# Altium project MicArrayPCB_V3.PrjPcb
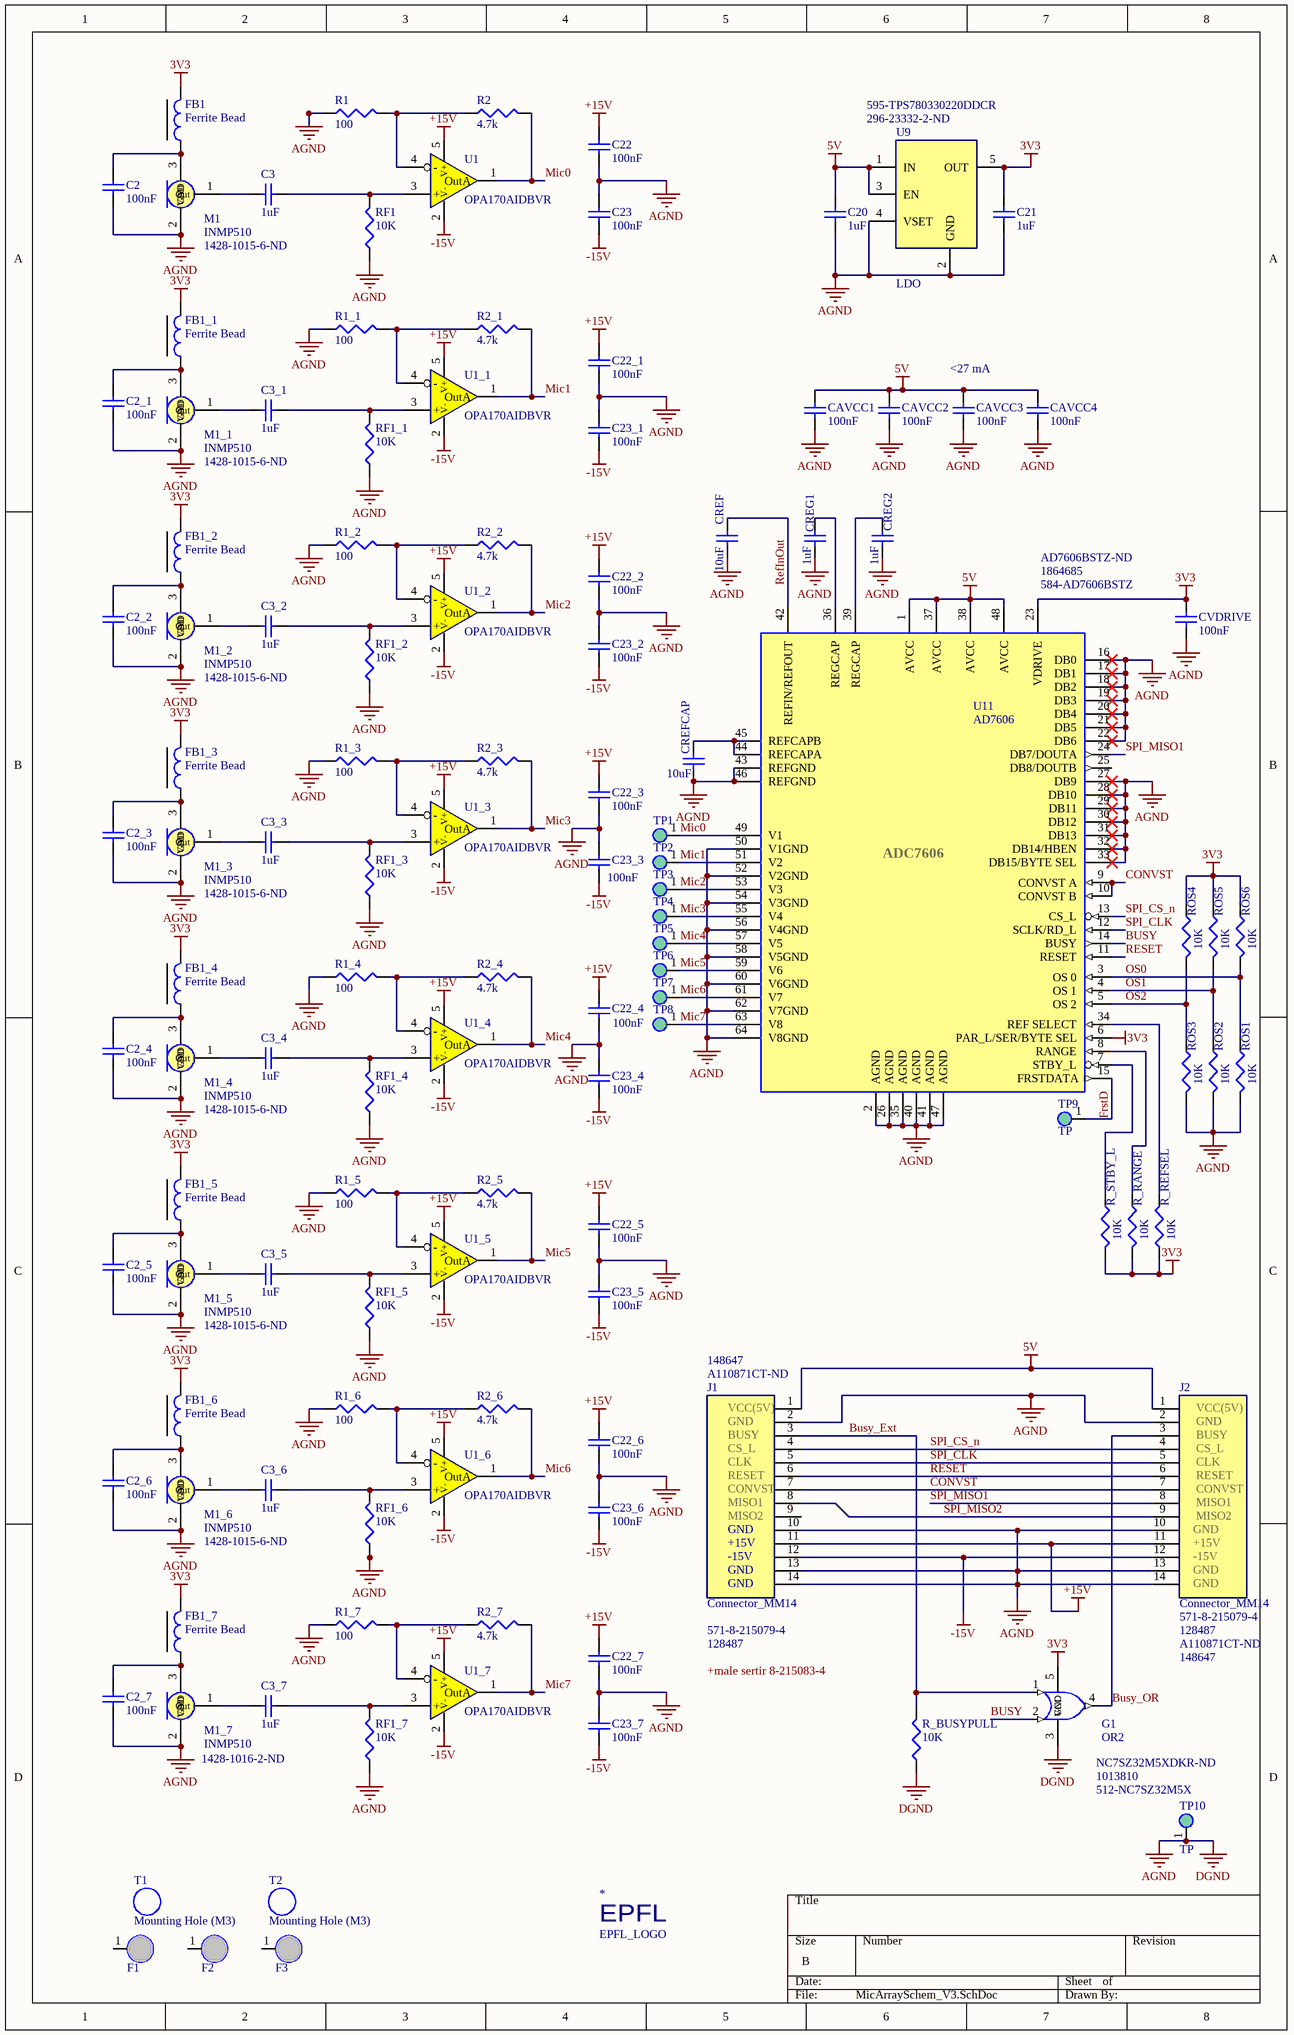
[diagram p0: MicArraySchem_V3.SchDoc]
1 sheet, 122 parts. Net scope: global (net labels, ports and power ports of the same name join across sheets).
Board file: MicArrayPCBBoard_V3.PcbDoc

## Sheet MicArraySchem_V3.SchDoc
size B portrait; PageSetup: Record=PageOptions|CenterHorizontal=True|CenterVertical=True|PrintScale=0.70|XCorrection=1.00|YCorrection=1.00|PrintKind=1|BorderSize=5000000|LeftOffset=0|BottomOffset=0|Orientation=1|PaperLength=2794|PaperWidth=2159|Scale=100|PaperSource=7|PrintQuality=600|MediaType=1|DitherType=10|PrintScaleMode=1|PaperKind=Letter (8,5" x 11")|PaperIndex=1

### Parts
*  EPFL_LOGO  [EPFL_Logo]
C2  100nF  [1608[0603]]
C2_1  100nF  [1608[0603]]
C2_2  100nF  [1608[0603]]
C2_3  100nF  [1608[0603]]
C2_4  100nF  [1608[0603]]
C2_5  100nF  [1608[0603]]
C2_6  100nF  [1608[0603]]
C2_7  100nF  [1608[0603]]
C3  1uF  [1608[0603]]
C3_1  1uF  [1608[0603]]
C3_2  1uF  [1608[0603]]
C3_3  1uF  [1608[0603]]
C3_4  1uF  [1608[0603]]
C3_5  1uF  [1608[0603]]
C3_6  1uF  [1608[0603]]
C3_7  1uF  [1608[0603]]
C20  1uF  [1608[0603]]
C21  1uF  [1608[0603]]
C22  100nF  [1608[0603]]
C22_1  100nF  [1608[0603]]
C22_2  100nF  [1608[0603]]
C22_3  100nF  [1608[0603]]
C22_4  100nF  [1608[0603]]
C22_5  100nF  [1608[0603]]
C22_6  100nF  [1608[0603]]
C22_7  100nF  [1608[0603]]
C23  100nF  [1608[0603]]
C23_1  100nF  [1608[0603]]
C23_2  100nF  [1608[0603]]
C23_3  100nF  [1608[0603]]
C23_4  100nF  [1608[0603]]
C23_5  100nF  [1608[0603]]
C23_6  100nF  [1608[0603]]
C23_7  100nF  [1608[0603]]
CAVCC1  100nF  [1608[0603]]
CAVCC2  100nF  [1608[0603]]
CAVCC3  100nF  [1608[0603]]
CAVCC4  100nF  [1608[0603]]
CREF  10uF  [1608[0603]]
CREFCAP  10uF  [1608[0603]]
CREG1  1uF  [1608[0603]]
CREG2  1uF  [1608[0603]]
CVDRIVE  100nF  [1608[0603]]
F1  *  [Fiducial_round_2mm]  (value not drawn)
F2  *  [Fiducial_round_2mm]  (value not drawn)
F3  *  [Fiducial_round_2mm]  (value not drawn)
FB1  Ferrite Bead  [L_0603]
FB1_1  Ferrite Bead  [L_0603]
FB1_2  Ferrite Bead  [L_0603]
FB1_3  Ferrite Bead  [L_0603]
FB1_4  Ferrite Bead  [L_0603]
FB1_5  Ferrite Bead  [L_0603]
FB1_6  Ferrite Bead  [L_0603]
FB1_7  Ferrite Bead  [L_0603]
G1  OR2  Supplier Part Number 1: 512-NC7SZ32M5X  Supplier Part Number 2: 1013810  Supplier Part Number 3: NC7SZ32M5XDKR-ND  [SOT65P210X110-5N]
J1  Connector_MM14  Supplier Part Number 2: 571-8-215079-4  Supplier Part Number 4: 128487  Supplier Part Number 3: A110871CT-ND  Supplier Part Number 1: 148647  [MM14 _TH_FEMALE]
J2  Connector_MM14  Supplier Part Number 2: 571-8-215079-4  Supplier Part Number 4: 128487  Supplier Part Number 3: A110871CT-ND  Supplier Part Number 1: 148647  [MM14 _TH_FEMALE]
M1  INMP510  Supplier Part Number 1: 1428-1015-6-ND  [INMP504]
M1_1  INMP510  Supplier Part Number 1: 1428-1015-6-ND  [INMP504]
M1_2  INMP510  Supplier Part Number 1: 1428-1015-6-ND  [INMP504]
M1_3  INMP510  Supplier Part Number 1: 1428-1015-6-ND  [INMP504]
M1_4  INMP510  Supplier Part Number 1: 1428-1015-6-ND  [INMP504]
M1_5  INMP510  Supplier Part Number 1: 1428-1015-6-ND  [INMP504]
M1_6  INMP510  Supplier Part Number 1: 1428-1015-6-ND  [INMP504]
M1_7  INMP510  Supplier Part Number 1: 1428-1016-2-ND  [INMP504]
R1  100  [J1-0603]
R1_1  100  [J1-0603]
R1_2  100  [J1-0603]
R1_3  100  [J1-0603]
R1_4  100  [J1-0603]
R1_5  100  [J1-0603]
R1_6  100  [J1-0603]
R1_7  100  [J1-0603]
R2  4.7k  [J1-0603]
R2_1  4.7k  [J1-0603]
R2_2  4.7k  [J1-0603]
R2_3  4.7k  [J1-0603]
R2_4  4.7k  [J1-0603]
R2_5  4.7k  [J1-0603]
R2_6  4.7k  [J1-0603]
R2_7  4.7k  [J1-0603]
R_BUSYPULL  10K  [J1-0603]
R_RANGE  10K  [J1-0603]
R_REFSEL  10K  [J1-0603]
R_STBY_L  10K  [J1-0603]
RF1  10K  [J1-0603]
RF1_1  10K  [J1-0603]
RF1_2  10K  [J1-0603]
RF1_3  10K  [J1-0603]
RF1_4  10K  [J1-0603]
RF1_5  10K  [J1-0603]
RF1_6  10K  [J1-0603]
RF1_7  10K  [J1-0603]
ROS1  10K  [J1-0603]
ROS2  10K  [J1-0603]
ROS3  10K  [J1-0603]
ROS4  10K  [J1-0603]
ROS5  10K  [J1-0603]
ROS6  10K  [J1-0603]
T1  Mounting Hole (M3)  [M3MountingHole]
T2  Mounting Hole (M3)  [M3MountingHole]
TP1  TP  [TP_0.75mm]  (value not drawn)
TP2  TP  [TP_0.75mm]  (value not drawn)
TP3  TP  [TP_0.75mm]  (value not drawn)
TP4  TP  [TP_0.75mm]  (value not drawn)
TP5  TP  [TP_0.75mm]  (value not drawn)
TP6  TP  [TP_0.75mm]  (value not drawn)
TP7  TP  [TP_0.75mm]  (value not drawn)
TP8  TP  [TP_0.75mm]  (value not drawn)
TP9  TP  [TP_0.75mm]
TP10  TP  [TP_1mm]
U1  OPA170AIDBVR  [SOT95P280X145-5N]
U1_1  OPA170AIDBVR  [SOT95P280X145-5N]
U1_2  OPA170AIDBVR  [SOT95P280X145-5N]
U1_3  OPA170AIDBVR  [SOT95P280X145-5N]
U1_4  OPA170AIDBVR  [SOT95P280X145-5N]
U1_5  OPA170AIDBVR  [SOT95P280X145-5N]
U1_6  OPA170AIDBVR  [SOT95P280X145-5N]
U1_7  OPA170AIDBVR  [SOT95P280X145-5N]
U9  LDO  Supplier Part Number 1: 296-23332-2-ND  Supplier Part Number 2: 595-TPS780330220DDCR  [SOT95P280X110-5N]
U11  AD7606  Supplier Part Number 1: AD7606BSTZ-ND  Supplier Part Number 2: 1864685  Supplier Part Number 3: 584-AD7606BSTZ  [LPQF-Quad64]

### Nets
3V3: C21.2 CVDRIVE.1 FB1.2 FB1_1.2 FB1_2.2 FB1_3.2 FB1_4.2 FB1_5.2 FB1_6.2 FB1_7.2 G1.5(VCC) R_RANGE.2 R_REFSEL.1 R_STBY_L.2 ROS4.1 ROS5.1 ROS6.1 U9.5(OUT) U11.6(PAR_L/SER/BYTE_SEL) U11.23(VDRIVE)
5V: C20.2 CAVCC1.2 CAVCC2.2 CAVCC3.2 CAVCC4.2 J1.1 J2.1 U9.1(IN) U9.3(EN) U11.1(AVCC) U11.37(AVCC) U11.38(AVCC) U11.48(AVCC)
+15V: C22.1 C22_1.1 C22_2.1 C22_3.1 C22_4.1 C22_5.1 C22_6.1 C22_7.1 J1.11 J2.11 U1.5(V+) U1_1.5(V+) U1_2.5(V+) U1_3.5(V+) U1_4.5(V+) U1_5.5(V+) U1_6.5(V+) U1_7.5(V+)
-15V: C23.2 C23_1.2 C23_2.2 C23_3.2 C23_4.2 C23_5.2 C23_6.2 C23_7.2 J1.12 J2.12 U1.2(V-) U1_1.2(V-) U1_2.2(V-) U1_3.2(V-) U1_4.2(V-) U1_5.2(V-) U1_6.2(V-) U1_7.2(V-)
AGND: C2.1 C2_1.1 C2_2.1 C2_3.1 C2_4.1 C2_5.1 C2_6.1 C2_7.1 C20.1 C21.1 C22.2 C22_1.2 C22_2.2 C22_3.2 C22_4.2 C22_5.2 C22_6.2 C22_7.2 C23.1 C23_1.1 C23_2.1 C23_3.1 C23_4.1 C23_5.1 C23_6.1 C23_7.1 CAVCC1.1 CAVCC2.1 CAVCC3.1 CAVCC4.1 CREF.1 CREFCAP.1 CREG1.1 CREG2.1 CVDRIVE.2 G1.3(GND) J1.2 J1.10 J1.13 J1.14 J2.2 J2.10 J2.13 J2.14 M1.2(GND) M1_1.2(GND) M1_2.2(GND) M1_3.2(GND) M1_4.2(GND) M1_5.2(GND) M1_6.2(GND) M1_7.2(GND) R1.1 R1_1.1 R1_2.1 R1_3.1 R1_4.1 R1_5.1 R1_6.1 R1_7.1 R_BUSYPULL.1 RF1.1 RF1_1.1 RF1_2.1 RF1_3.1 RF1_4.1 RF1_5.1 RF1_6.1 RF1_7.1 ROS1.2 ROS2.2 ROS3.2 TP10.1(TP) U9.2(GND) U9.4(VSET) U11.2(AGND) U11.16(DB0) U11.17(DB1) U11.18(DB2) U11.19(DB3) U11.20(DB4) U11.21(DB5) U11.22(DB6) U11.26(AGND) U11.27(DB9) U11.28(DB10) U11.29(DB11) U11.30(DB12) U11.31(DB13) U11.32(DB14/HBEN) U11.33(DB15/BYTE_SEL) U11.35(AGND) U11.40(AGND) U11.41(AGND) U11.43(REFGND) U11.46(REFGND) U11.47(AGND) U11.50(V1GND) U11.52(V2GND) U11.54(V3GND) U11.56(V4GND) U11.58(V5GND) U11.60(V6GND) U11.62(V7GND) U11.64(V8GND)  [also labelled DGND]
BUSY: G1.2 U11.14(BUSY)
Busy_Ext: G1.1 J1.3 R_BUSYPULL.2
Busy_OR: G1.4 J2.3
CONVST: J1.7 J2.7 U11.9(CONVST_A) U11.10(CONVST_B)
FrstD: TP9.1(TP) U11.15(FRSTDATA)
Mic0: R2.2 TP1.1(TP) U1.1(OutA) U11.49(V1)
Mic1: R2_1.2 TP2.1(TP) U1_1.1(OutA) U11.51(V2)
Mic2: R2_2.2 TP3.1(TP) U1_2.1(OutA) U11.53(V3)
Mic3: R2_3.2 TP4.1(TP) U1_3.1(OutA) U11.55(V4)
Mic4: R2_4.2 TP5.1(TP) U1_4.1(OutA) U11.57(V5)
Mic5: R2_5.2 TP6.1(TP) U1_5.1(OutA) U11.59(V6)
Mic6: R2_6.2 TP7.1(TP) U1_6.1(OutA) U11.61(V7)
Mic7: R2_7.2 TP8.1(TP) U1_7.1(OutA) U11.63(V8)
OS0: ROS1.1 ROS6.2 U11.3(OS_0)
OS1: ROS2.1 ROS5.2 U11.4(OS_1)
OS2: ROS3.1 ROS4.2 U11.5(OS_2)
RefInOut: CREF.2 U11.42(REFIN/REFOUT)
RESET: J1.6 J2.6 U11.11(RESET)
SPI_CLK: J1.5 J2.5 U11.12(SCLK/RD_L)
SPI_CS_n: J1.4 J2.4 U11.13(CS_L)
SPI_MISO1: J2.8 U11.24(DB7/DOUTA)
SPI_MISO2: J1.8 J2.9
NetC2_1_2: C2_1.2 FB1_1.1 M1_1.3(VDD)
NetC2_2: C2.2 FB1.1 M1.3(VDD)
NetC2_2_2: C2_2.2 FB1_2.1 M1_2.3(VDD)
NetC2_3_2: C2_3.2 FB1_3.1 M1_3.3(VDD)
NetC2_4_2: C2_4.2 FB1_4.1 M1_4.3(VDD)
NetC2_5_2: C2_5.2 FB1_5.1 M1_5.3(VDD)
NetC2_6_2: C2_6.2 FB1_6.1 M1_6.3(VDD)
NetC2_7_2: C2_7.2 FB1_7.1 M1_7.3(VDD)
NetC3_1: C3.1 M1.1(Out)
NetC3_1_1: C3_1.1 M1_1.1(Out)
NetC3_1_2: C3_1.2 RF1_1.2 U1_1.3(+)
NetC3_2: C3.2 RF1.2 U1.3(+)
NetC3_2_1: C3_2.1 M1_2.1(Out)
NetC3_2_2: C3_2.2 RF1_2.2 U1_2.3(+)
NetC3_3_1: C3_3.1 M1_3.1(Out)
NetC3_3_2: C3_3.2 RF1_3.2 U1_3.3(+)
NetC3_4_1: C3_4.1 M1_4.1(Out)
NetC3_4_2: C3_4.2 RF1_4.2 U1_4.3(+)
NetC3_5_1: C3_5.1 M1_5.1(Out)
NetC3_5_2: C3_5.2 RF1_5.2 U1_5.3(+)
NetC3_6_1: C3_6.1 M1_6.1(Out)
NetC3_6_2: C3_6.2 RF1_6.2 U1_6.3(+)
NetC3_7_1: C3_7.1 M1_7.1(Out)
NetC3_7_2: C3_7.2 RF1_7.2 U1_7.3(+)
NetCREFCAP_2: CREFCAP.2 U11.44(REFCAPA) U11.45(REFCAPB)
NetCREG1_2: CREG1.2 U11.36(REGCAP)
NetCREG2_2: CREG2.2 U11.39(REGCAP)
NetR1_1_2: R1_1.2 R2_1.1 U1_1.4(-)
NetR1_2: R1.2 R2.1 U1.4(-)
NetR1_2_2: R1_2.2 R2_2.1 U1_2.4(-)
NetR1_3_2: R1_3.2 R2_3.1 U1_3.4(-)
NetR1_4_2: R1_4.2 R2_4.1 U1_4.4(-)
NetR1_5_2: R1_5.2 R2_5.1 U1_5.4(-)
NetR1_6_2: R1_6.2 R2_6.1 U1_6.4(-)
NetR1_7_2: R1_7.2 R2_7.1 U1_7.4(-)
NetR_RANGE_1: R_RANGE.1 U11.8(RANGE)
NetR_REFSEL_2: R_REFSEL.2 U11.34(REF_SELECT)
NetR_STBY_L_1: R_STBY_L.1 U11.7(STBY_L)

Not connected (* = marked no-connect by the designer): F1 1; F2 1; F3 1; J1 9; U11 25(DB8/DOUTB)

### Notes on the sheet
- (near CAVCC3) <27 mA
- (near J1) VCC(5V)
- (near J1) GND
- (near J1) BUSY
- (near J2) VCC(5V)
- (near J2) GND
- (near J2) BUSY
- (near J1) CLK
- (near J1) CS_L
- (near J1) CONVST
- (near J1) RESET
- (near J1) MISO1
- (near J1) MISO2
- (near J2) CLK
- (near J2) CS_L
- (near J2) CONVST
- (near J2) RESET
- (near J2) MISO1
- (near J2) MISO2
- (near J1) +15V
- (near J1) -15V
- (near J2) +15V
- (near J2) -15V
- +male sertir 8-215083-4
- (in symbol AD7606) ADC7606
- (in symbol EPFL_LOGO) EPFL

### Library data of the parts
C2 C2_1-C2_7 C3 C3_1-C3_7 C20-C22 C22_1-C22_7 C23 C23_1-C23_7 CAVCC1-CAVCC4 CREF CREFCAP CREG1 CREG2 CVDRIVE = Cap Semi: Capacitor (Semiconductor SIM Model)
  C2 C2_1-C2_7 CAVCC1-CAVCC4 CVDRIVE: Published: 8-Jun-2000; LatestRevisionDate: 29-May-2009; LatestRevisionNote: IPC-7351 Footprint Added.; PackageReference: C1206; Publisher: Altium Limited; PackageDescription: Chip Capacitor; Value: 100nF
  C3: Package: 0603; Value: 1uF
  C3_1-C3_7 C20 C21 CREG1 CREG2: Published: 8-Jun-2000; LatestRevisionDate: 29-May-2009; LatestRevisionNote: IPC-7351 Footprint Added.; PackageReference: C1206; Publisher: Altium Limited; PackageDescription: Chip Capacitor; Value: 1uF
  C22 C22_1-C22_7 C23 C23_1-C23_7: Published: 8-Jun-2000; LatestRevisionDate: 29-May-2009; LatestRevisionNote: IPC-7351 Footprint Added.; PackageReference: 1608[0603]; Publisher: Altium Limited; PackageDescription: Chip Capacitor; Value: 100nF
  CREF CREFCAP: Published: 8-Jun-2000; LatestRevisionDate: 29-May-2009; LatestRevisionNote: IPC-7351 Footprint Added.; PackageReference: C1206; Publisher: Altium Limited; PackageDescription: Chip Capacitor; Value: 10uF
F1-F3 = Reference: Value: *
FB1 FB1_1-FB1_7 = Ferrite Bead: Ferrite bead.; HelpURL: http://www.mouser.com/ds/2/445/74279264-372895.pdf; Price: ~$2.00
G1 = OR2: TinyOR2; HelpURL: http://www.mouser.com/ds/2/149/NC7SZ32-98735.pdf; Supplier 1: Mouser; Supplier 2: Farnell; Supplier 3: Digi-Key
M1 M1_1-M1_7 = Mic: INMP504; HelpURL: http://www.invensense.com/wp-content/uploads/2015/02/INMP504.pdf; Price: $1.96; Supplier 1: Digi-Key
  M1_7: Value: INMP510
R1 R1_1-R1_7 R2 R2_1-R2_7 R_BUSYPULL R_RANGE R_REFSEL R_STBY_L RF1 RF1_1-RF1_7 ROS1-ROS6 = Res3: Resistor; Published: 8-Jun-2000; LatestRevisionDate: 29-May-2009; LatestRevisionNote: IPC-7351 Footprint Added.; PackageReference: J1-0603; Publisher: Altium Limited; PackageDescription: Chip Resistor
  R1 R1_1-R1_7: Value: 100
  R2 R2_1-R2_7: Value: 4.7k
  R_BUSYPULL R_RANGE R_REFSEL R_STBY_L RF1 RF1_1-RF1_7 ROS1-ROS6: Value: 10K
U1 U1_1-U1_7 = OPA170: Supplier 1: Digi-Key; Supplier 2: Digi-Key; Supplier 3: Mouser; Supplier 4: Farnell; Supplier Part Number 1: 296-29496-1-ND; Supplier Part Number 2: 296-39103-6-ND; Supplier Part Number 3: 595-OPA170AIDBVR; Supplier Part Number 4: 2057089
U9 = LDO: TPS780330220DDCR; HelpURL: http://www.mouser.com/ds/2/405/tps780-558349.pdf; Price: $1.13; Supplier 1: Digi-Key; Supplier 2: Mouser
J1 J2 = Connector_MM14: Supplier 1: Farnell; Supplier 2: Mouser; Supplier 3: Digi-Key; Supplier4: Distrelec
U11 = AD7606: HelpURL: http://www.mouser.com/ds/2/609/AD7606-278669.pdf; Price: $27.12; Supplier 1: Digi-Key; Supplier 2: Farnell; Supplier 3: Mouser